# EAGLE board APSR3350 (EAGLE 9.5.0), part 1 of 2
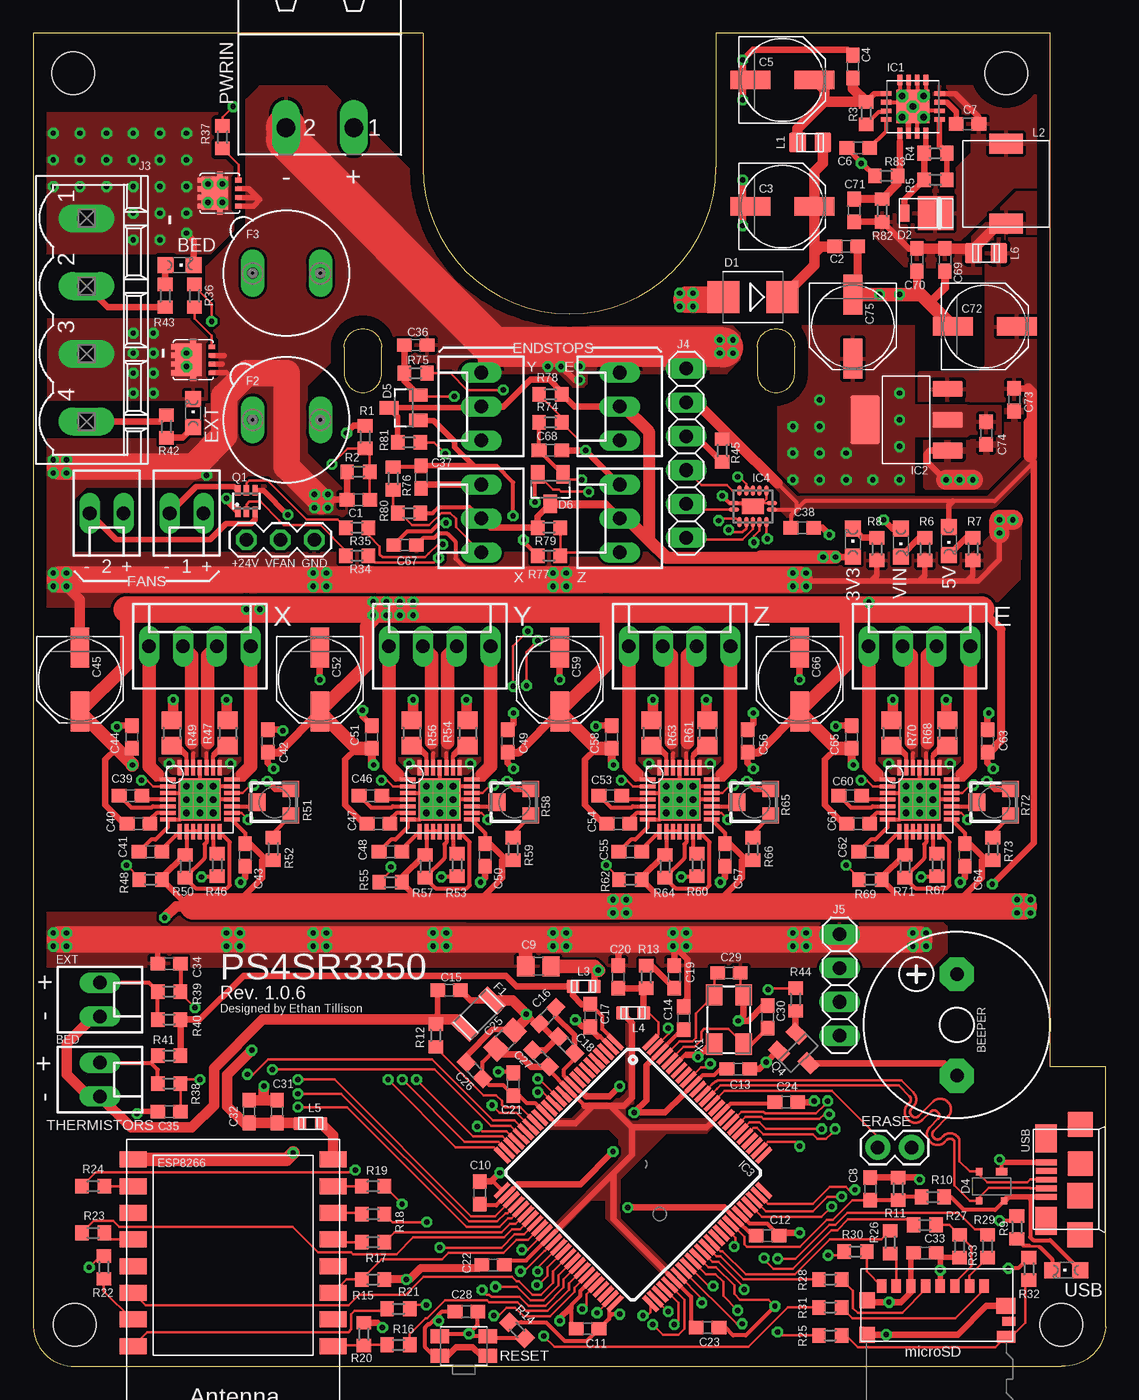
[diagram p6: board, top side]
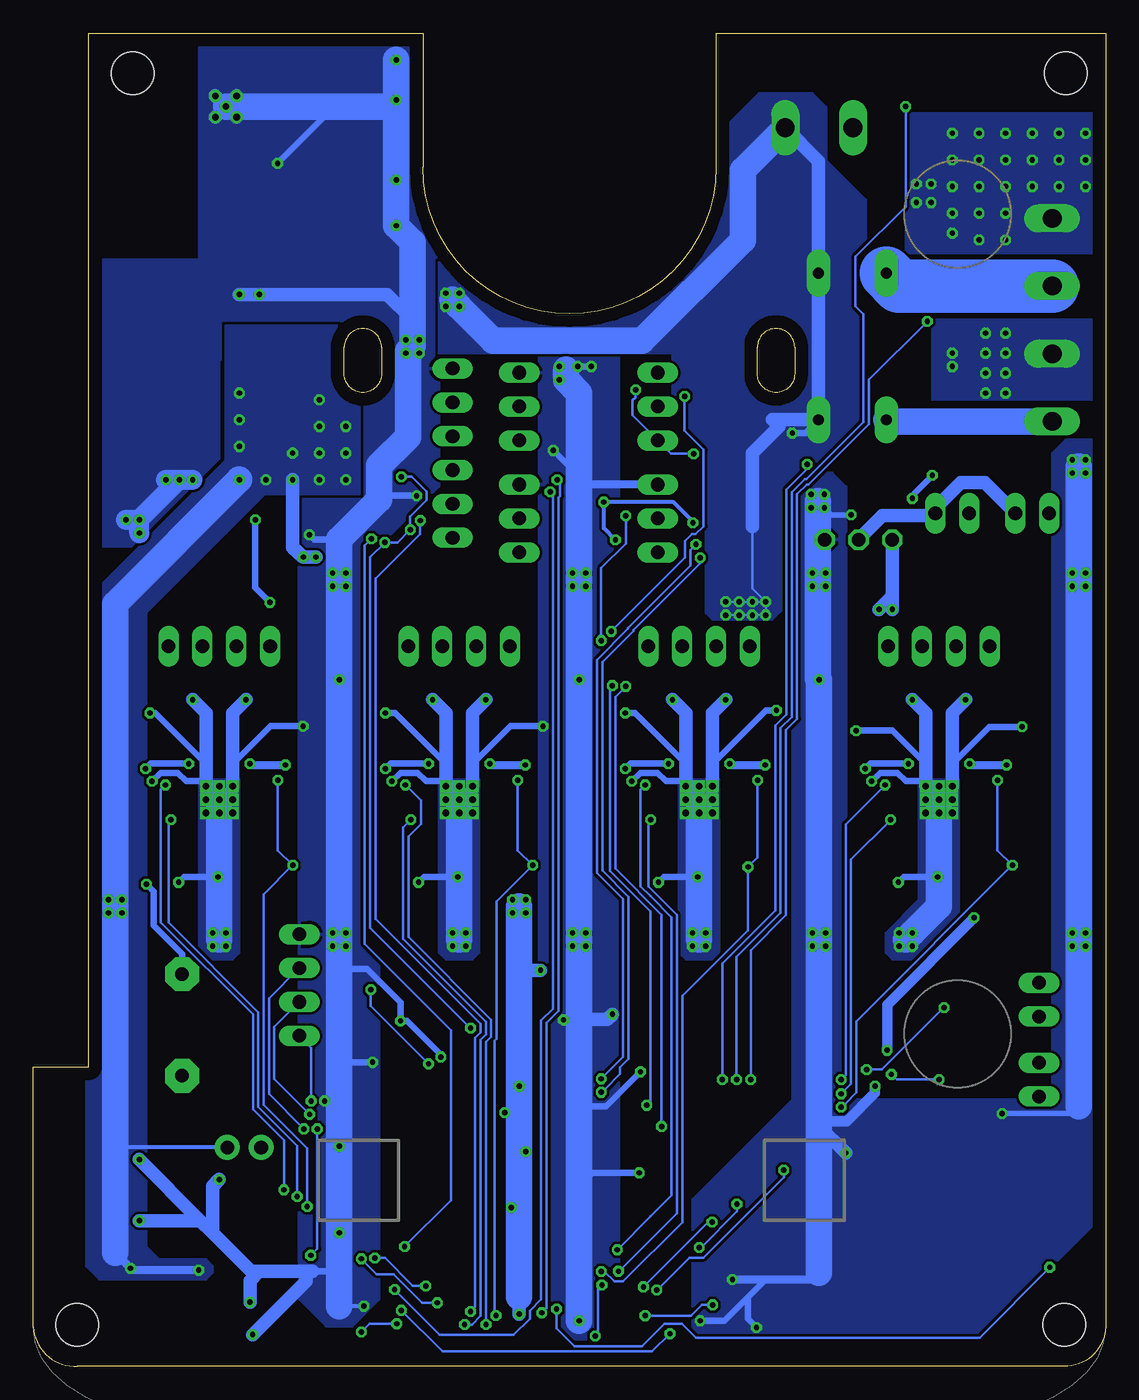
[diagram p7: board, bottom side, seen from below]

Size 80.46 x 100 mm. Coordinates in mm from the lower left corner, seen from the top.
Outline: 0,100 0,2.95 arc90 3.11,0 77.15,0 arc90 80.46,2.95 80.46,22.45 76.32,22.45 76.32,100 51.23,100 51.23,89.95 arc-180 29.23,89.95 29.23,100 0,100
Outline: 23.33,76.45 23.33,74.45 arc180 26.13,74.45 26.13,76.45 arc180 23.33,76.45
Outline: 54.33,76.45 54.33,74.45 arc180 57.13,74.45 57.13,76.45 arc180 54.33,76.45
Copper layers (1*16): Top 0.035mm / dielectric 1.5mm / Bottom 0.035mm
Design rules "default *": minimum track width 0.2mm, minimum drill 0.4mm, track to track 0.2mm, track to pad 0.25mm, pad to pad 0.2mm, via to via 0.2mm, smd to smd 0.2mm, copper to edge 1mm, drill to drill 0.15mm, minimum pad ring 10mil, minimum via ring 8mil, stop-mask expansion 0mil, vias tented up to drill 16.5mil, thermal gap 0.25mm
Net classes: 1 USB: width 0.102 mm, drill 0.1 mm; 2 gnd: width 0.102 mm, drill 0.1 mm; 3 usbvcc: width 0.102 mm, drill 0.1 mm, clearance 0.15 mm; 4 diff: width 0.2 mm
Holes 3.2 mm at 77.15,3.11 3,97 3.11,3.11 73,97
tKeepout: area 70,94 to 76,100; area 74.2,0.1 to 80.2,6.1; area 0.1,0.1 to 6.1,6.1; area 0,94 to 6,100

## Footprints (pad centres in the part's own frame; a part is rotated, then mirrored left to right if it is on the bottom)
CHIPLED_0805 = smd 1.2 x 1.2: A 0,-1.05; C 0,1.05
MOLEX-KK-254-2 = drill 1.02 long: 1 -1.27,0; 2 1.27,0
F/CM12P = drill 1.016 pad 2.54 octagon: + 3.81,0; - -3.81,0
C0603 = smd 1.1 x 1: 1 -0.85,0; 2 0.85,0
PANASONIC_D = smd 3 x 1.4: + 2.4,0; - -2.4,0
C0805 = smd 1.3 x 1.5: 1 -0.95,0; 2 0.95,0
SMB = smd 2.4 x 2.4: A 2.2,0; C -2.2,0
DO220AAL = smd 2.667 x 2.54: P$1 -0.7,0 | smd 0.762 x 1.27: P$2 1.65,0
SOT143B = smd 0.88 x 0.55: 1 -0.75,-1.1 | smd 0.48 x 0.55: 2 0.95,-1.1; 3 0.95,1.1; 4 -0.95,1.1
SOT23 = smd 1 x 1.4: 1 -0.95,-1.1; 2 0.95,-1.1; 3 0,1.1
MOLEX-KK-254-4 = drill 1.02 long: 1 -3.81,0; 2 -1.27,0; 3 1.27,0; 4 3.81,0
MOLEX-KK-254-3 = drill 1.02 long: 1 -2.54,0; 2 0,0; 3 2.54,0
1X02 = drill 1.016 pad 1.88: 1 0,0; 2 2.54,0
ESP-12 = smd 2 x 1.2: 1 -7.5,4.5; 2 -7.5,2.5; 3 -7.5,0.5; 4 -7.5,-1.5; 5 -7.5,-3.5; 6 -7.5,-5.5; 7 -7.5,-7.5; 8 -7.5,-9.5; 9 7.5,-9.5; 10 7.5,-7.5; 11 7.5,-5.5; 12 7.5,-3.5; 13 7.5,-1.5; 14 7.5,0.5; 15 7.5,2.5; 16 7.5,4.5
MC36207 = smd 1 x 2: 1 -1.45,0; 2 1.45,0
19560 = drill 0.813 pad 1.778 long: 1 -2.54,0; 2 2.54,0
QFN16-4X4 = smd 0.8 x 0.35: 1 -2,0.975; 2 -2,0.325; 3 -2,-0.325; 4 -2,-0.975; 9 2,-0.975; 10 2,-0.325; 11 2,0.325; 12 2,0.975 | smd 0.35 x 0.8: 5 -0.975,-2; 6 -0.325,-2; 7 0.325,-2; 8 0.975,-2; 13 0.975,2; 14 0.325,2; 15 -0.325,2; 16 -0.975,2 | smd 2.5 x 2.5: EXP 0,0
SOT223 = smd 2.235 x 1.219: 1 -3.099,2.311; 2 -3.099,0; 3 -3.099,-2.311 | smd 2.2 x 3.6: 4 3.099,0
LQFP100 = smd 1.5 x 0.35: 1 -7.875,6; 2 -7.875,5.5; 3 -7.875,5; 4 -7.875,4.5; 5 -7.875,4; 6 -7.875,3.5; 7 -7.875,3; 8 -7.875,2.5; 9 -7.875,2; 10 -7.875,1.5; 11 -7.875,1; 12 -7.875,0.5; 13 -7.875,0; 14 -7.875,-0.5; 15 -7.875,-1; 16 -7.875,-1.5; 17 -7.875,-2; 18 -7.875,-2.5; 19 -7.875,-3; 20 -7.875,-3.5; 21 -7.875,-4; 22 -7.875,-4.5; 23 -7.875,-5; 24 -7.875,-5.5; 25 -7.875,-6; 51 7.875,-6; 52 7.875,-5.5; 53 7.875,-5; 54 7.875,-4.5; 55 7.875,-4; 56 7.875,-3.5; 57 7.875,-3; 58 7.875,-2.5; 59 7.875,-2; 60 7.875,-1.5; 61 7.875,-1; 62 7.875,-0.5; 63 7.875,0; 64 7.875,0.5; 65 7.875,1; 66 7.875,1.5; 67 7.875,2; 68 7.875,2.5; 69 7.875,3; 70 7.875,3.5; 71 7.875,4; 72 7.875,4.5; 73 7.875,5; 74 7.875,5.5; 75 7.875,6 | smd 0.35 x 1.5: 26 -6.025,-7.875; 27 -5.525,-7.875; 28 -5.025,-7.875; 29 -4.525,-7.875; 30 -4.025,-7.875; 31 -3.525,-7.875; 32 -3.025,-7.875; 33 -2.525,-7.875; 34 -2.025,-7.875; 35 -1.525,-7.875; 36 -1.025,-7.875; 37 -0.525,-7.875; 38 -0.025,-7.875; 39 0.475,-7.875; 40 0.975,-7.875; 41 1.475,-7.875; 42 1.975,-7.875; 43 2.475,-7.875; 44 2.975,-7.875; 45 3.475,-7.875; 46 3.975,-7.875; 47 4.475,-7.875; 48 4.975,-7.875; 49 5.475,-7.875; 50 5.975,-7.875; 76 6,7.875; 77 5.5,7.875; 78 5,7.875; 79 4.5,7.875; 80 4,7.875; 81 3.5,7.875; 82 3,7.875; 83 2.5,7.875; 84 2,7.875; 85 1.5,7.875; 86 1,7.875; 87 0.5,7.875; 88 0,7.875; 89 -0.5,7.875; 90 -1,7.875; 91 -1.5,7.875; 92 -2,7.875; 93 -2.5,7.875; 94 -3,7.875; 95 -3.5,7.875; 96 -4,7.875; 97 -4.5,7.875; 98 -5,7.875; 99 -5.5,7.875; 100 -6,7.875
DHVQFN14 = smd 0.8 x 0.35: 1 -1.425,-0.25; 7 1.425,-0.25; 8 1.425,0.25; 14 -1.425,0.25 | smd 0.35 x 0.8: 2 -1,-1.175; 3 -0.5,-1.175; 4 0,-1.175; 5 0.5,-1.175; 6 1,-1.175; 9 1,1.175; 10 0.5,1.175; 11 0,1.175; 12 -0.5,1.175; 13 -1,1.175 | smd 1.65 x 1.15: EXP 0,0
QFN28-TP = smd 1.15 x 0.3: 1 -2.4,1.5; 2 -2.4,1; 3 -2.4,0.5; 4 -2.4,0; 5 -2.4,-0.5; 6 -2.4,-1; 7 -2.4,-1.5; 15 2.4,-1.5; 16 2.4,-1; 17 2.4,-0.5; 18 2.4,0; 19 2.4,0.5; 20 2.4,1; 21 2.4,1.5 | smd 0.3 x 1.15: 8 -1.5,-2.4; 9 -1,-2.4; 10 -0.5,-2.4; 11 0,-2.4; 12 0.5,-2.4; 13 1,-2.4; 14 1.5,-2.4; 22 1.5,2.4; 23 1,2.4; 24 0.5,2.4; 25 0,2.4; 26 -0.5,2.4; 27 -1,2.4; 28 -1.5,2.4 | smd 3.15 x 3.15: PAD 0,0
USB-MICRO-10103594 = smd 0.4 x 1.6: D+ 0,0; D- -0.65,0; GND 1.3,0; ID 0.65,0; VBUS -1.3,0 | smd 1.9 x 1.9: SHLD1 -1.2,-2.55; SHLD2 1.2,-2.55; SHLD3 -4.15,-2.55; SHLD4 4.15,-2.55 | smd 2.1 x 1.6: SHLD5 3.1,0; SHLD6 -3.1,0
MOLEX-47571 = smd 0.7 x 1: 1 3.85,0; 2 2.75,0; 3 1.65,0; 4 0.55,0; 5 -0.55,0; 6 -1.65,0; 7 -2.75,0; 8 -3.85,0 | smd 1.15 x 1.2: G1 -4.925,-1.05; G2 -4.925,-3.64 | smd 1.45 x 1.2: G3 5.475,-1.49 | smd 1 x 0.7: G4 5.7,-2.64 | smd 1.4 x 0.9: G5 5.5,-3.79
MSTBV4 = drill 1.397 long: 1 -7.62,0; 2 -2.54,0; 3 2.54,0; 4 7.62,0
1X06 = drill 1.016 long: 1 -6.35,0; 2 -3.81,0; 3 -1.27,0; 4 1.27,0; 5 3.81,0; 6 6.35,0
1X04 = drill 1.016 long: 1 -3.81,0; 2 -1.27,0; 3 1.27,0; 4 3.81,0
C0805' = smd 1.5 x 1.25: 1 0,0.95; 2 0,-0.95
SRR0604 = smd 1.5 x 2.5: P$1 3,0; P$2 -3,0
C0603' = smd 1 x 0.95: 1 0,0.8; 2 0,-0.8
MSTBA2 = drill 1.397 long: 1 -2.54,5.08; 2 2.54,5.08
SOT363_PHILIPS = smd 0.4 x 0.8: 1 -0.65,-0.8; 2 0,-0.8; 3 0.65,-0.8; 4 0.65,0.8; 5 0,0.8; 6 -0.65,0.8
3X3DFN-EP = smd 0.35 x 0.5: 1 -0.975,-1.4; 2 -0.325,-1.4; 3 0.325,-1.4; 4 0.975,-1.4 | smd 0.4 x 0.3: 5 0.975,1.5; 6 0.325,1.5; 7 -0.325,1.5; 8 -0.975,1.5 | smd 0.38 x 0.43: E1 -1.415,0; E2 1.415,0 | smd 2.45 x 1.98: PAD 0,0.36
SOT23-BEC = smd 1 x 1.4: B -0.95,-1.1; C 0,1.1; E 0.95,-1.1
R0603 = smd 1 x 1.1: 1 -0.85,0; 2 0.85,0
R0805 = smd 1.3 x 1.5: 1 -0.95,0; 2 0.95,0
RTRIM3103 = smd 1.2 x 1.25: 1 -1,-1.225; 3 1,-1.225 | smd 1.3 x 1.3: 2 0,1.3
EVQP7 = smd 1.4 x 1.05: 1A -1.8,0.725; 1B 1.8,0.725; 2A -1.8,-0.725; 2B 1.8,-0.725
1X03_SMALL = drill 1.016 octagon: 1 0,0; 2 2.54,0; 3 5.08,0
5.0X3.2_KX-9A = smd 1.6 x 1.25: 1 -1.85,-1.1; 2 1.85,-1.1; 3 1.85,1.1; 4 -1.85,1.1

## Placement (x,y rotation side)
3V3  [CHIPLED_0805]  61.5,61.8 0 top
5V  [CHIPLED_0805]  68.7,61.9 180 top
BED  KK-254-2  [MOLEX-KK-254-2]  5,21.5 270 top
BED_L  [CHIPLED_0805]  11,82.6 270 top
BEEPER  F/CM12P  [F/CM12P]  69.3,25.6 90 top
C1  10n  [C0603]  24.4,65 180 top
C2  10u  [C0603]  61,84 0 top
C3  100u  [PANASONIC_D]  56.2,87 0 top
C4  10u  [C0603]  61.5,97.5 90 top
C5  100u  [PANASONIC_D]  56.2,96.5 0 top
C6  100n  [C0603]  61.9,91.4 180 top
C7  22n  [C0603]  70.1,93.2 0 top
C8  100n  [C0603]  62.8,13.3 270 top
C9  10u  [C0805]  37.9,30 0 top
C10  100n  [C0603]  33.5,13 270 top
C11  100n  [C0603]  41.6,2.8 0 top
C12  100n  [C0603]  55.1,9.8 180 top
C13  100n  [C0603]  52.9,22.3 180 top
C14  100n  [C0603]  48.8,26.1 270 top
C15  2.2u  [C0603]  31.2,28.2 0 top
C16  100n  [C0603]  38.6,26.3 225 top
C17  100n  [C0603]  41.8,26.3 270 top
C18  10u  [C0603]  40,24.1 135 top
C19  4u7  [C0603]  48.1,29.2 90 top
C20  100n  [C0603]  43.9,29.2 90 top
C21  100n  [C0603]  36.02,21.15 90 top
C22  100n  [C0603]  34.5,7.6 180 top
C23  100n  [C0603]  50.6,2.9 0 top
C24  100n  [C0603]  56.5,19.8 0 top
C25  10u  [C0805]  35.4,24.5 45 top
C26  100n  [C0603]  33.1,22.2 135 top
C27  2.2u 0.1-10ohm ESR  [C0603]  38.1,23.1 135 top
C28  10n  [C0603]  32.5,4.1 180 top
C29  10p  [C0603]  52.2,29.5 0 top
C30  10p  [C0603]  55.1,26.2 90 top
C31  10u  [C0603]  18.3,19.1 90 top
C32  10u  [C0603]  16.2,19.1 90 top
C33  2K2  [C0603]  66.9,8.5 180 top
C34  2.2u  [C0603]  10.2,30.2 180 top
C35  2.2u  [C0603]  10.2,19.1 180 top
C36  2.2u  [C0603]  28.7,76.6 0 top
C37  2.2u  [C0603]  29.1,66.7 270 top
C38  100n  [C0603]  57.7,62.9 0 top
C39  100n  [C0603]  7.3,42.8 180 top
C40  100n  [C0603]  7.9,40.7 180 top
C41  220n  [C0603]  8.8,38.6 180 top
C42  100n  [C0603]  17.6,46.9 90 top
C43  220n  [C0603]  15.9,38.35 270 top
C44  100n  [C0603]  7.4,47.2 90 top
C45  100u  [PANASONIC_D]  3.5,51.5 270 top
C46  100n  [C0603]  25.3,42.8 180 top
C47  100n  [C0603]  25.9,40.7 180 top
C48  220n  [C0603]  26.8,38.6 180 top
C49  100n  [C0603]  35.6,46.9 90 top
C50  220n  [C0603]  33.9,38.35 270 top
C51  100n  [C0603]  25.4,47.2 90 top
C52  100u  [PANASONIC_D]  21.5,51.5 270 top
C53  100n  [C0603]  43.3,42.8 180 top
C54  100n  [C0603]  43.9,40.7 180 top
C55  220n  [C0603]  44.8,38.6 180 top
C56  100n  [C0603]  53.6,46.9 90 top
C57  220n  [C0603]  51.9,38.35 270 top
C58  100n  [C0603]  43.4,47.2 90 top
C59  100u  [PANASONIC_D]  39.5,51.5 270 top
C60  100n  [C0603]  61.3,42.8 180 top
C61  100n  [C0603]  61.9,40.7 180 top
C62  220n  [C0603]  62.8,38.6 180 top
C63  100n  [C0603]  71.6,46.9 90 top
C64  220n  [C0603]  69.9,38.35 270 top
C65  100n  [C0603]  61.4,47.2 90 top
C66  100u  [PANASONIC_D]  57.5,51.5 270 top
C67  2.2u  [C0603]  27.89,61.6 0 top
C68  2.2u  [C0603]  38.8,68.7 0 top
C69  10u  [C0603]  68.4,83 270 top
C70  10u  [C0603]  66.3,83 270 top
C71  10n  [C0603]  61.6,86.7 90 top
C72  220u  [PANASONIC_D]  71.4,78 0 top
C73  10u  [C0603]  73.6,72.5 270 top
C74  10u  [C0603]  71.5,70 270 top
C75  10u  [PANASONIC_D]  61.5,78 270 top
D1  [SMB]  54,80.2 180 top
D2  SS1P3L  [DO220AAL]  67,86.5 180 top
D4  PRTR5V0U2XB  [SOT143B]  71.9,13.5 180 top
D5  BAT54C  [SOT23]  27.8,71.9 90 top
D6  BAT54C  [SOT23]  38.8,65.8 180 top
E  KK-254-4  [MOLEX-KK-254-4]  66.5,54 0 top
E_STOP  KK-254-3  [MOLEX-KK-254-3]  44,72 90 top
ERASE  [1X02]  65.9,16.4 180 top
ESP8266  [ESP-12]  15,6 180 top
EXT  KK-254-2  [MOLEX-KK-254-2]  5,27.5 270 top
EXT_L  [CHIPLED_0805]  12,71.5 0 top
F1  MC36207  [MC36207]  33.4,26.4 45 top
F2  [19560]  19,71 180 top
F3  [19560]  19,82 180 top
FAN1  KK-254-2  [MOLEX-KK-254-2]  11.5,64 180 top
FAN2  KK-254-2  [MOLEX-KK-254-2]  5.5,64 180 top
IC1  A4403  [QFN16-4X4]  66,94.5 0 top
IC2  LDO-TS1117CW-3V3  [SOT223]  65.5,71 180 top
IC3  ATSAM4S8C  [LQFP100]  45,14.5 315 top
IC4  74AHC08  [DHVQFN14]  54,64.5 180 top
IC7  A4988  [QFN28-TP]  12.5,42.5 0 top
IC8  A4988  [QFN28-TP]  30.5,42.5 0 top
IC9  A4988  [QFN28-TP]  48.5,42.5 0 top
IC10  A4988  [QFN28-TP]  66.5,42.5 0 top
J1  ZX62-AB-5PA  [USB-MICRO-10103594]  76,14 90 top
J2  MOLEX-SD-47571-001  [MOLEX-47571]  67.5,6 0 top
J3  MSTBV4  [MSTBV4]  4,78.5 270 top
J4  [1X06]  49,68.5 90 top
J5  [1X04]  60.5,28.6 90 top
L1  MH2029-300Y  [C0805']  58.3,91.8 270 top
L2  10uH  [SRR0604]  73,88.7 90 top
L3  10uH 100MHz  [C0603']  41.3,28.5 90 top
L4  10uH 100MHz  [C0603']  45,26.5 270 top
L5  4n7H  [C0603']  20.8,18.2 90 top
L6  MPZ2012S221A  [C0805']  71.5,83.5 90 top
PWRIN  MSTBA2  [MSTBA2]  21.5,98 180 top
Q1  NX138BKS  [SOT363_PHILIPS]  16,64.9 0 top
Q2  AON7524  [3X3DFN-EP]  12,75.5 90 top
Q3  AON7524  [3X3DFN-EP]  14,88 90 top
Q4  BC817-16SMD  [SOT23-BEC]  57.4,23.5 225 top
R1  47K  [R0603]  24.9,69.7 90 top
R2  4.7K  [R0603]  24.4,67.1 0 top
R3  100K  [R0603]  62.5,94 90 top
R4  0R1  [R0603]  67.7,91 180 top
R5  0R1  [R0603]  67.7,89 180 top
R6  4K7  [R0603]  66.9,61.3 270 top
R7  2K2  [R0603]  70.5,61.3 270 top
R8  180R  [R0603]  63.3,61.3 270 top
R9  2K2  [R0603]  73.8,10.4 90 top
R10  27K  [R0603]  67.5,12.7 180 top
R11  47K  [R0603]  64.9,13.3 90 top
R12  10K  [R0603]  30.2,24.8 90 top
R13  1R  [R0603]  46,29.2 270 top
R14  10K  [R0603]  36.3,2.7 135 top
R15  4K7  [R0603]  25.5,6.5 0 top
R16  470R  [R0603]  27.4,1.6 180 top
R17  47R  [R0603]  25.5,9.3 0 top
R18  47R  [R0603]  25.5,11.4 0 top
R19  47R  [R0603]  25.5,13.5 0 top
R20  2K2  [R0603]  24.8,2.4 270 top
R21  2K2  [R0603]  27.4,4.3 180 top
R22  470R  [R0603]  5.3,7.4 270 top
R23  2K2  [R0603]  4.5,10 0 top
R24  2K2  [R0603]  4.5,13.5 0 top
R25  220R  [R0603]  59.8,2.3 0 top
R26  220R  [R0603]  64.3,9.3 270 top
R27  220R  [R0603]  66.9,10.6 0 top
R28  100R  [R0603]  59.8,6.5 0 top
R29  220R  [R0603]  71.6,9 270 top
R30  220R  [R0603]  61.7,8.6 0 top
R31  220R  [R0603]  59.8,4.4 0 top
R32  10K  [R0603]  74.7,7.3 90 top
R33  10K  [R0603]  69.5,9 270 top
R34  1K  [R0603]  24.3,60.8 180 top
R35  1K  [R0603]  24.3,62.9 180 top
R36  180R  [R0603]  12.1,80.3 270 top
R37  180R  [R0603]  14.2,92.2 270 top
R38  10K  [R0603]  10.2,21.2 180 top
R39  10K  [R0603]  10.2,28.1 180 top
R40  4K7 0.1%  [R0603]  10.2,26 0 top
R41  4K7 0.1%  [R0603]  10.2,23.3 0 top
R42  4K7  [R0603]  10,70.5 90 top
R43  4K7  [R0603]  9.9,80.3 270 top
R44  1K  [R0603]  57.2,27.5 270 top
R45  47R  [R0603]  51.7,68.7 270 top
R46  10K  [R0603]  13.8,37.6 270 top
R47  0R2  [R0805]  14.6,47.5 270 top
R48  10K  [R0603]  8.8,36.5 0 top
R49  0R2  [R0805]  10.4,47.5 270 top
R50  100K  [R0603]  11.4,37.5 90 top
R51  10K  [RTRIM3103]  18.1,42.3 90 top
R52  20K  [R0603]  18,38.8 270 top
R53  10K  [R0603]  31.8,37.6 270 top
R54  0R2  [R0805]  32.6,47.5 270 top
R55  10K  [R0603]  26.8,36.3 0 top
R56  0R2  [R0805]  28.4,47.5 270 top
R57  100K  [R0603]  29.4,37.5 90 top
R58  10K  [RTRIM3103]  36.1,42.3 90 top
R59  20K  [R0603]  36,38.8 270 top
R60  10K  [R0603]  49.8,37.6 270 top
R61  0R2  [R0805]  50.6,47.5 270 top
R62  10K  [R0603]  44.8,36.5 0 top
R63  0R2  [R0805]  46.4,47.5 270 top
R64  100K  [R0603]  47.4,37.5 90 top
R65  10K  [RTRIM3103]  54.1,42.3 90 top
R66  20K  [R0603]  54,38.8 270 top
R67  10K  [R0603]  67.8,37.6 270 top
R68  0R2  [R0805]  68.6,47.5 270 top
R69  10K  [R0603]  62.8,36.5 0 top
R70  0R2  [R0805]  64.4,47.5 270 top
R71  100K  [R0603]  65.4,37.5 90 top
R72  10K  [RTRIM3103]  72.1,42.3 90 top
R73  20K  [R0603]  72,38.8 270 top
R74  10K  [R0603]  38.8,70.8 0 top
R75  10K  [R0603]  28.7,74.5 0 top
R76  10K  [R0603]  27,66.6 270 top
R77  10K  [R0603]  38.7,60.8 0 top
R78  10K  [R0603]  38.8,72.9 0 top
R79  10K  [R0603]  38.7,62.9 180 top
R80  10K  [R0603]  28.2,64 0 top
R81  10K  [R0603]  28.2,69.3 180 top
R82  3K92  [R0603]  63.7,86.7 270 top
R83  750R  [R0603]  64,89.3 0 top
RESET  EVQP7J  [EVQP7]  32.3,1.5 0 top
USB_L  [CHIPLED_0805]  77.5,7.2 90 top
VFAN  [1X03_SMALL]  16,62 0 top
VIN  [CHIPLED_0805]  65.1,61.8 180 top
X  KK-254-4  [MOLEX-KK-254-4]  12.5,54 0 top
X1  12MHz  [5.0X3.2_KX-9A]  52.2,26 90 top
X_STOP  KK-254-3  [MOLEX-KK-254-3]  33.6,72 90 top
Y  KK-254-4  [MOLEX-KK-254-4]  30.5,54 0 top
Y_STOP  KK-254-3  [MOLEX-KK-254-3]  33.6,63.6 90 top
Z  KK-254-4  [MOLEX-KK-254-4]  48.5,54 0 top
Z_STOP  KK-254-3  [MOLEX-KK-254-3]  44,63.6 90 top